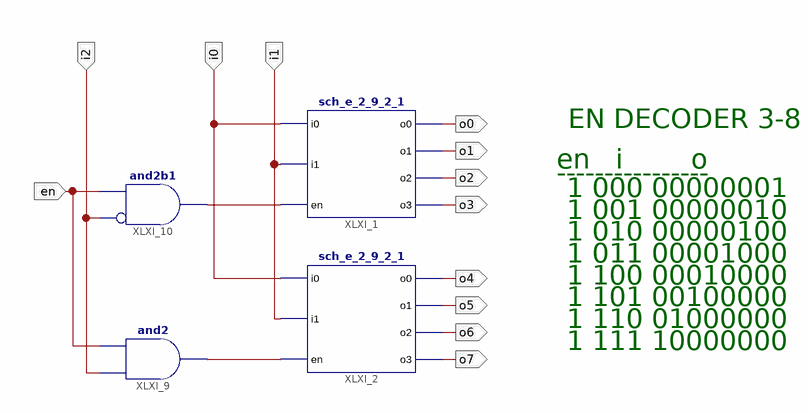
[diagram p0: schematic sheet 1]
// Xilinx ISE schematic sch_e_2_9_2_4.sch (spartan3e) as structural Verilog: 4 symbols, 12 ports
module sch_e_2_9_2_4 (
  input  i2,
  input  en,
  input  i1,
  input  i0,
  output o0,
  output o1,
  output o2,
  output o3,
  output o4,
  output o5,
  output o6,
  output o7
);

  wire XLXN_3, XLXN_4;

  sch_e_2_9_2_1 XLXI_1 (.i0(i0), .i1(i1), .en(XLXN_3), .o0(o0), .o1(o1), .o2(o2), .o3(o3));
  sch_e_2_9_2_1 XLXI_2 (.i0(i0), .i1(i1), .en(XLXN_4), .o0(o4), .o1(o5), .o2(o6), .o3(o7));
  and XLXI_9 (XLXN_4, i2, en);
  and XLXI_10 (XLXN_3, ~i2, en);  // and2b1

  // Notes on the sheet:
  //   EN DECODER 3-8
  //   en   i        o
  //   ----------------
  //   1 000 00000001
  //   1 001 00000010
  //   1 010 00000100
  //   1 011 00001000
  //   1 100 00010000
  //   1 101 00100000
  //   1 110 01000000
  //   1 111 10000000
endmodule
